# EAGLE schematic 7segement4minidigits1badidea-mk-1 (EAGLE 6.5.0)
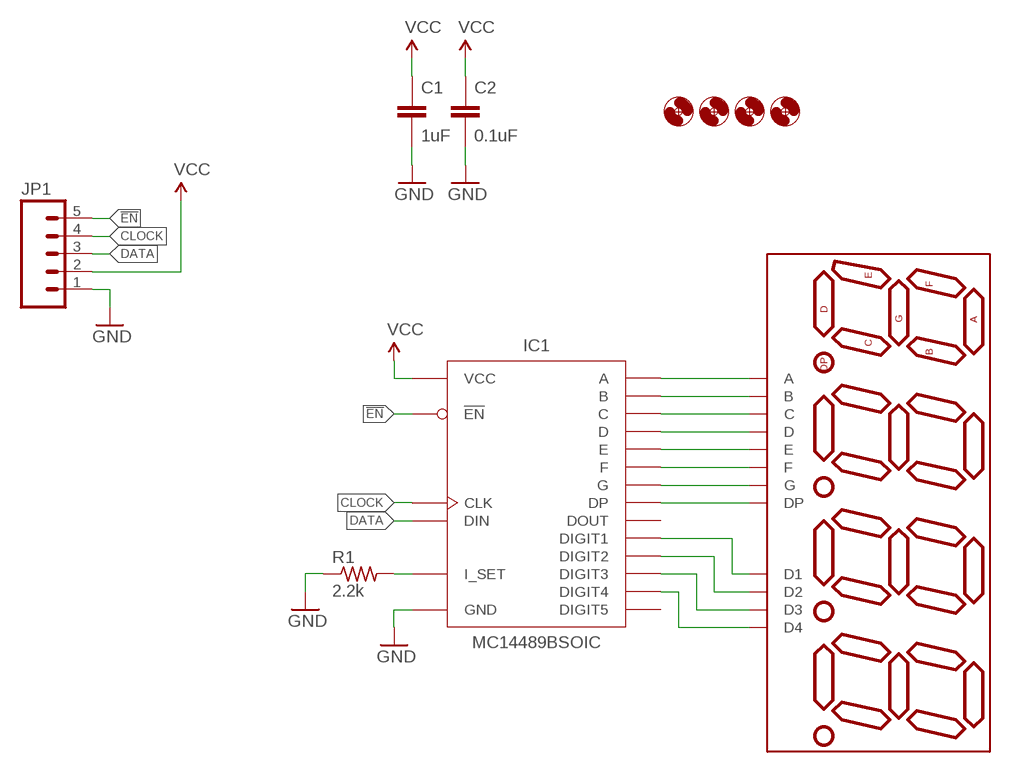
[diagram p0: schematic, sheet 1]

## Parts
C1  1uF  CAPACITOR-CERAMIC025-024X044  [C025-024X044]
C2  0.1uF  CAPACITOR-CERAMIC025-024X044  [C025-024X044]
DISP1  BUBBLES!  7-SEGMENT-4DIGIT-COUNTER-HP-BUBBLE  [DIL12]
H1  HOLE#2  [HOLE-#2]
H2  HOLE#2  [HOLE-#2]
H3  HOLE#2  [HOLE-#2]
H4  HOLE#2  [HOLE-#2]
IC1  MC14489BSOIC  [SOP20W]
JP1  M05PTH  [1X05]
R1  2.2k  RESISTORPTH-AXIAL-5.08MM  [RESISTOR-AXIAL-PTH-5.08MM]

## Nets
!EN: IC1.10(!EN) JP1.5
CLOCK: IC1.11(CLK) JP1.4
DATA: IC1.12(DIN) JP1.3
GND: C1.2 C2.2 IC1.14(GND) JP1.1 R1.P$1
N$1: DISP1.12(A) IC1.7(A)
N$2: DISP1.11(B) IC1.6(B)
N$3: DISP1.3(C) IC1.5(C)
N$4: DISP1.8(D) IC1.4(D)
N$5: DISP1.2(E) IC1.2(E)
N$6: DISP1.9(F) IC1.1(F)
N$7: DISP1.7(G) IC1.20(G)
N$8: DISP1.5(DP) IC1.19(DP)
N$9: DISP1.1(D1) IC1.9(DIGIT1)
N$10: DISP1.10(D2) IC1.13(DIGIT2)
N$11: DISP1.4(D3) IC1.15(DIGIT3)
N$12: DISP1.6(D4) IC1.16(DIGIT4)
N$15: IC1.8(I_SET) R1.P$2
VCC: C1.1 C2.1 IC1.3(VCC) JP1.2
Unconnected: IC1.17(DIGIT5) IC1.18(DOUT)

## Library data of the parts
C1 C2 = A_butts:CAPACITOR-CERAMIC: CAPACITOR, European symbol
DISP1 = A_butts:7-SEGMENT-4DIGIT-COUNTER; STOREFRONT: COM-12710
H1-H4 = A_butts:HOLE: MOUNTING HOLE with drill center marker
IC1 = A_butts:MC14489B
JP1 = A_butts:M05: Header 5 Standard 5-pin 0.1" header. Use with straight break away headers (SKU : PRT-00116), right angle break away headers (PRT-00553), swiss pins (PRT-00743), machine pins (PRT-00117), and female headers (PRT-00115). Molex polarized connector foot print use with SKU : PRT-08230 with associated crimp pins and housings.
R1 = A_butts:RESISTOR: RESISTOR, American symbol